# Altium schematic sheet Main.SchDoc
size A4; DocumentNumber: 1; SheetNumber: 1; SheetTotal: 6
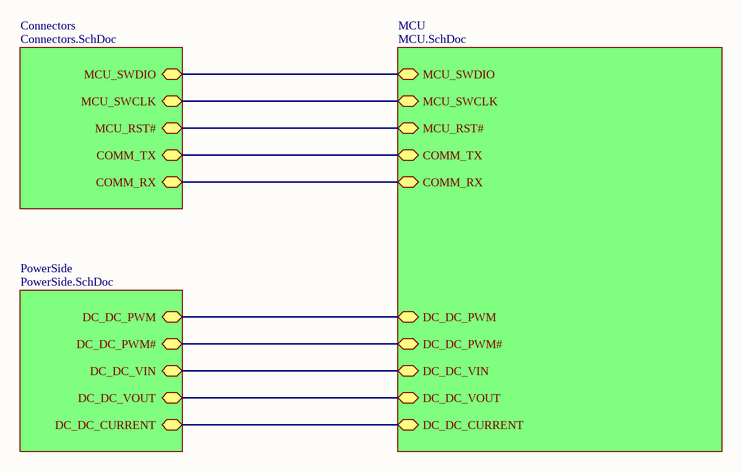
[diagram p0: Main.SchDoc]

## Sub-sheets
Connectors = Connectors.SchDoc: MCU_SWDIO, MCU_SWCLK, MCU_RST#, COMM_TX, COMM_RX
MCU = MCU.SchDoc: MCU_SWDIO, MCU_SWCLK, MCU_RST#, DC_DC_PWM, DC_DC_PWM#, DC_DC_VIN, DC_DC_VOUT, DC_DC_CURRENT, COMM_TX, COMM_RX
PowerSide = PowerSide.SchDoc: DC_DC_PWM, DC_DC_PWM#, DC_DC_VIN, DC_DC_VOUT, DC_DC_CURRENT

## Nets
(unnamed): sheet Connectors/MCU_SWDIO, sheet MCU/MCU_SWDIO
(unnamed): sheet Connectors/MCU_SWCLK, sheet MCU/MCU_SWCLK
(unnamed): sheet Connectors/MCU_RST#, sheet MCU/MCU_RST#
(unnamed): sheet Connectors/COMM_TX, sheet MCU/COMM_TX
(unnamed): sheet Connectors/COMM_RX, sheet MCU/COMM_RX
(unnamed): sheet MCU/DC_DC_PWM, sheet PowerSide/DC_DC_PWM
(unnamed): sheet MCU/DC_DC_PWM#, sheet PowerSide/DC_DC_PWM#
(unnamed): sheet MCU/DC_DC_VIN, sheet PowerSide/DC_DC_VIN
(unnamed): sheet MCU/DC_DC_VOUT, sheet PowerSide/DC_DC_VOUT
(unnamed): sheet MCU/DC_DC_CURRENT, sheet PowerSide/DC_DC_CURRENT

## Notes on the sheet
- Project:
- Title:
- HW Rev:
- Author:
- Date:
- Sheet
- of